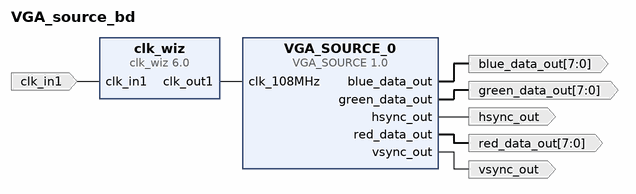
[diagram p0: block diagram of the top level]
# Vivado block design VGA_source_bd, xc7z020clg484-1, Vivado 2018.3
create_bd_design VGA_source_bd

create_bd_port -dir O -from 7 -to 0 red_data_out
create_bd_port -dir O -from 7 -to 0 green_data_out
create_bd_port -dir O -from 7 -to 0 blue_data_out
create_bd_port -dir O hsync_out
create_bd_port -dir O vsync_out
create_bd_port -dir I -type clk clk_in1

create_bd_cell -type ip -vlnv xilinx.com:user:VGA_SOURCE:1.0 VGA_SOURCE_0
create_bd_cell -type ip -vlnv xilinx.com:ip:clk_wiz:6.0 clk_wiz

# ---- connections ----

connect_bd_net [get_bd_pins VGA_SOURCE_0/red_data_out] [get_bd_ports red_data_out]
connect_bd_net [get_bd_pins VGA_SOURCE_0/green_data_out] [get_bd_ports green_data_out]
connect_bd_net [get_bd_pins VGA_SOURCE_0/blue_data_out] [get_bd_ports blue_data_out]
connect_bd_net [get_bd_pins VGA_SOURCE_0/hsync_out] [get_bd_ports hsync_out]
connect_bd_net [get_bd_pins VGA_SOURCE_0/vsync_out] [get_bd_ports vsync_out]
connect_bd_net [get_bd_pins clk_wiz/clk_out1] [get_bd_pins VGA_SOURCE_0/clk_108MHz]
connect_bd_net -net clk_in1_0_1 [get_bd_ports clk_in1] [get_bd_pins clk_wiz/clk_in1]

validate_bd_design
save_bd_design
